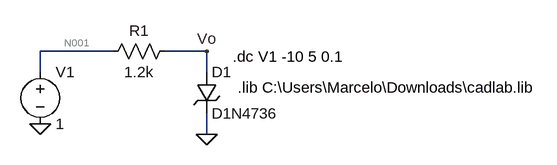
[diagram p0: schematic Sim_Zener.asc]
Sim_Zener.asc, the LTspice schematic file:
Version 4
SHEET 1 880 680
WIRE 144 96 32 96
WIRE 288 96 224 96
WIRE 32 128 32 96
WIRE 288 128 288 96
WIRE 288 224 288 192
FLAG 288 224 0
FLAG 32 208 0
FLAG 288 96 Vo
SYMBOL zener 272 128 R0
SYMATTR InstName D1
SYMATTR Value D1N4736
SYMBOL res 240 80 R90
WINDOW 0 0 56 VBottom 2
WINDOW 3 32 56 VTop 2
SYMATTR InstName R1
SYMATTR Value 1.2k
SYMBOL voltage 32 112 R0
WINDOW 123 0 0 Left 2
WINDOW 39 0 0 Left 2
SYMATTR InstName V1
SYMATTR Value 1
TEXT 328 104 Left 2 !.dc V1 -10 5 0.1
TEXT 336 152 Left 2 !.lib C:\\Users\\Marcelo\\Downloads\\cadlab.lib

The netlist it stands for:
* Sim_Zener.asc
D1 Vo 0 D1N4736
R1 Vo N001 1.2k
V1 N001 0 1
.model D D
.lib standard.dio
.dc V1 -10 5 0.1
.lib C:\Users\Marcelo\Downloads\cadlab.lib
.backanno
.end

* Results of the author's LTspice run, read from the files saved beside the schematic
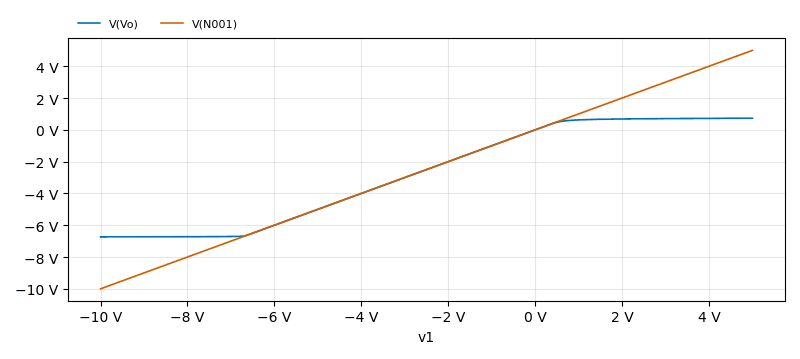
[diagram p1: DC transfer characteristic of Sim_Zener.asc, plotted from the saved traces]
* DC transfer characteristic, 1 run:
*   V(Vo): -6.734 V at v1=-10 V, 731.3 mV at v1=5 V, min -6.734 V, max 731.3 mV
*   V(N001): -10 V at v1=-10 V, 5 V at v1=5 V, min -10 V, max 5 V